# EAGLE design holiday-candleholder (EAGLE 6.6.0)
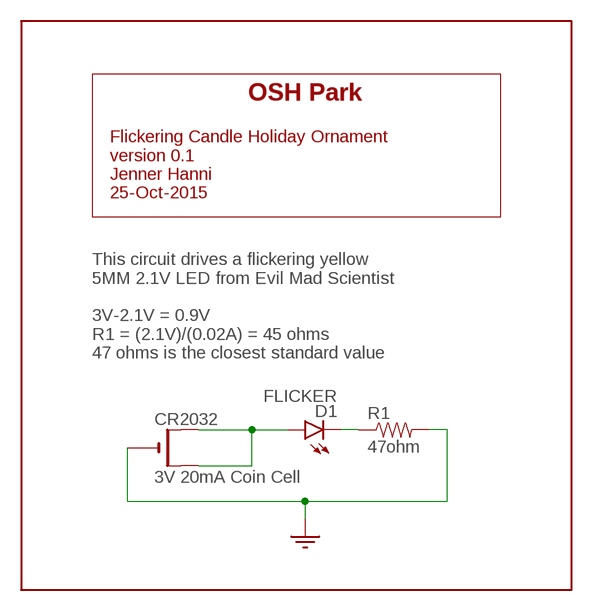
[diagram p0: schematic, sheet 1]

## Parts
CR2032  3V 20mA Coin Cell  CR2032STRAP  [CR2032-BATT-STRAP-MPD]
D1  FLICKER  LED5MM  [LED5MM]
R1  47ohm  RESISTOR  [RES-CF14-TH]

## Nets
GND: CR2032.- R1.P$2
N$1: CR2032.+$1(+) CR2032.+$2(+1) D1.A
N$3: D1.K(C) R1.P$1

## Notes on the sheet
- OSH Park
- Flickering Candle Holiday Ornament 
  version 0.1
  Jenner Hanni
  25-Oct-2015
- This circuit drives a flickering yellow 
  5MM 2.1V LED from Evil Mad Scientist
  
  3V-2.1V = 0.9V
  R1 = (2.1V)/(0.02A) = 45 ohms
  47 ohms is the closest standard value

## Library data of the parts
CR2032 = adafruit:CR2032
D1 = SparkFun-LED:LED: LEDs Standard schematic elements and footprints for 5mm, 3mm, 1206, and 0603 sized LEDs. 5mm - Spark Fun Electronics SKU : COM-00529 (and others)
R1 = e202var-receiver:RESISTOR

## Board
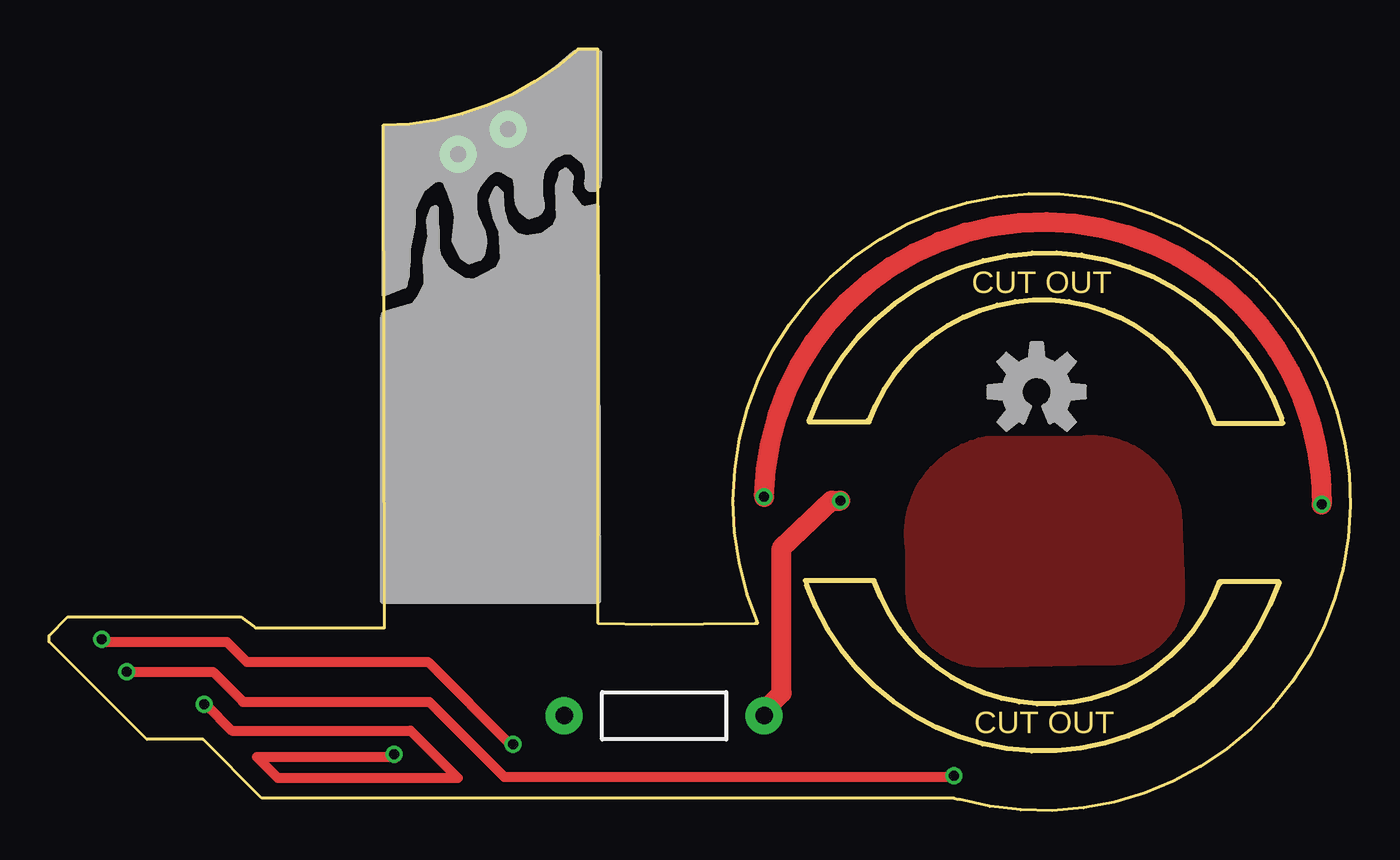
[diagram p1: board, top side]
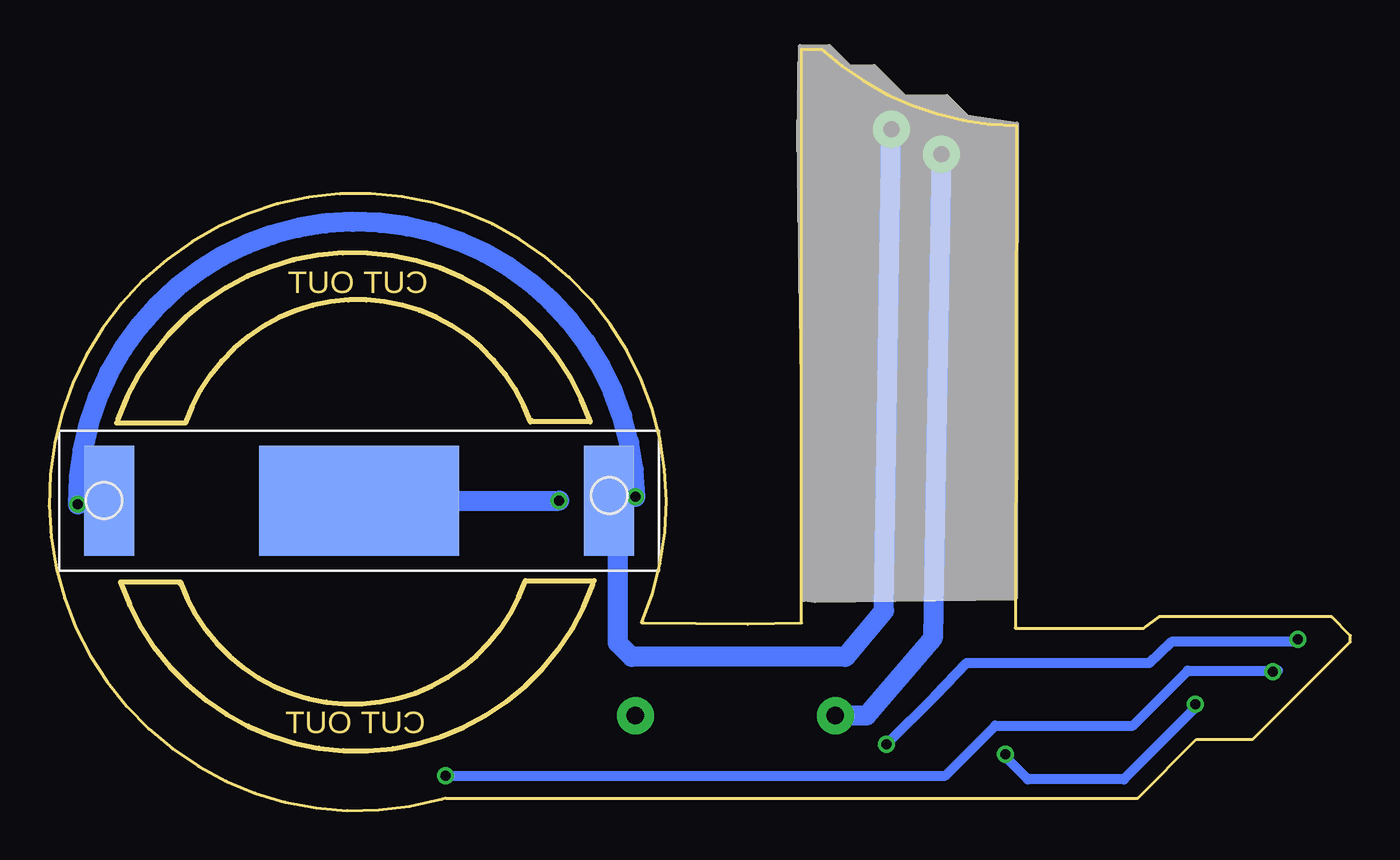
[diagram p2: board, bottom side, seen from below]

Size 66.1 x 38.66 mm. Coordinates in mm from the lower left corner, seen from the top.
Outline: 10.48,9.26 17.02,9.26 16.95,34.79 arc42 26.86,38.66 27.88,38.66 27.88,9.52 30.61,9.45 35.88,9.52 36,9.52 arc-309 46.23,0.56
Outline: 10.41,9.33 9.72,9.83 0.95,9.83 0,8.88 0,8.56 4.95,3.61 7.81,3.61 10.8,0.63 45.97,0.63 46.16,0.56
Outline: 41.66,19.74 arc-142 59.18,19.68 62.67,19.68 62.61,19.74
Outline: 62.61,19.87 arc142 38.61,19.74 41.66,19.74
Outline: 41.66,19.74 41.59,19.8
Outline: 59.44,11.61 arc-142 41.91,11.68 38.42,11.68 38.48,11.61
Outline: 38.48,11.48 arc142 62.48,11.61 59.44,11.61
Outline: 59.44,11.61 59.5,11.55
Copper layers (1*16): Top 0.0356mm / dielectric 1.5011mm / Bottom 0.0356mm
Design rules "oshpark-2layer": minimum track width 6mil, minimum drill 13mil, track to track 6mil, track to pad 6mil, pad to pad 6mil, via to via 6mil, smd to smd 6mil, copper to edge 15mil, drill to drill 6mil, minimum pad ring 7mil, minimum via ring 7mil, stop-mask expansion 4mil, vias tented up to drill 0mil, thermal gap 10mil

### Footprints (pad centres in the part's own frame; a part is rotated, then mirrored left to right if it is on the bottom)
CR2032-BATT-STRAP-MPD = smd 2.54 x 5.588: +$1 -12.7,0; +$2 12.7,0 | smd 10.16 x 5.588: - 0,0
LED5MM = drill 0.813 pad 1.88: A -1.27,0; K 1.27,1.27
RES-CF14-TH = drill 0.889 pad 1.88: P$1 -4.826,-0.254; P$2 5.334,-0.254

### Placement (x,y rotation side)
CR2032  50.36,15.74 0 bottom
D1  22.03,34.6 180 top
R1  30.99,5.07 0 top
U$2  [OSHW_LOGO_MED_SYM]  50.17,21.26 0 top

### Tracks (layer width: path | path; a pad name or v marks a point on that pad's centre or on a via)
GND  (via drill 0.51)
  Top 1.016: R1.P$2 36.32,5.07 37.21,5.96 37.21,13.33 39.75,15.74 v40.2,15.74
  Bottom 1.016: CR2032.- v40.2,15.74
N$1  (via drill 0.51)
  Top 1.016: v36.32,15.93 arc-180 v64.64,15.55
  Bottom 1.016: CR2032.+$1 64.45,15.74 v64.64,15.55 arc180 v36.32,15.93 37.46,15.93 CR2032.+$2 37.21,15.29 37.21,8.5 36.51,7.8 25.65,7.8 23.69,10.15 D1.A
N$3
  Bottom 1.016: D1.K 21.21,8.75 24.57,4.82 R1.P$1
N$8
  Top 0.508: 2.92,8.56 9.02,8.56 10.03,7.55 19.24,7.55 23.5,3.29
N$9  (via drill 0.51)
  Top 0.508: 3.75,7.04 v3.94,7.04 8.32,7.04 9.84,5.52 19.3,5.52 23.11,1.71 45.72,1.71
N$10  (via drill 0.51)
  Top 0.508: v7.87,5.39 7.94,5.39 9.27,4.06 18.35,4.06 20.76,1.64 11.62,1.64 10.54,2.72 17.53,2.72 17.59,2.66
N$11  (via drill 0.51)
  other vias: 17.53,2.85
N$12  (via drill 0.51)
  other vias: 2.67,8.69
N$18  (via drill 0.51)
  other vias: 23.56,3.36
N$19  (via drill 0.51)
  other vias: 45.97,1.77
N$20
  Bottom 0.508: 2.67,8.56 9.08,8.56 10.22,7.48 19.49,7.48 21.08,5.83 23.56,3.36
N$21
  Bottom 0.508: 7.75,5.26 7.81,5.26 11.49,1.58 16.38,1.58 17.53,2.72
N$22
  Bottom 0.508: 46.1,1.77 20.57,1.77 18.03,4.31 11.05,4.31 8.25,7.1 3.68,7.1
N$23
  pour Top: 47.69,18.79 52.32,18.79 arc-90 57.28,15.1 57.47,10.85 arc-90 53.4,7.61 47.31,7.48 arc-90 43.75,11.48 43.75,13.2 arc-90

### Text on the board
Dimension: CUT OUT | CUT OUT
tStop: Happy / Holidays / from / OSH Park!
bStop: Happy Holidays / from OSH Park! | Happy Holidays / from OSH Park!